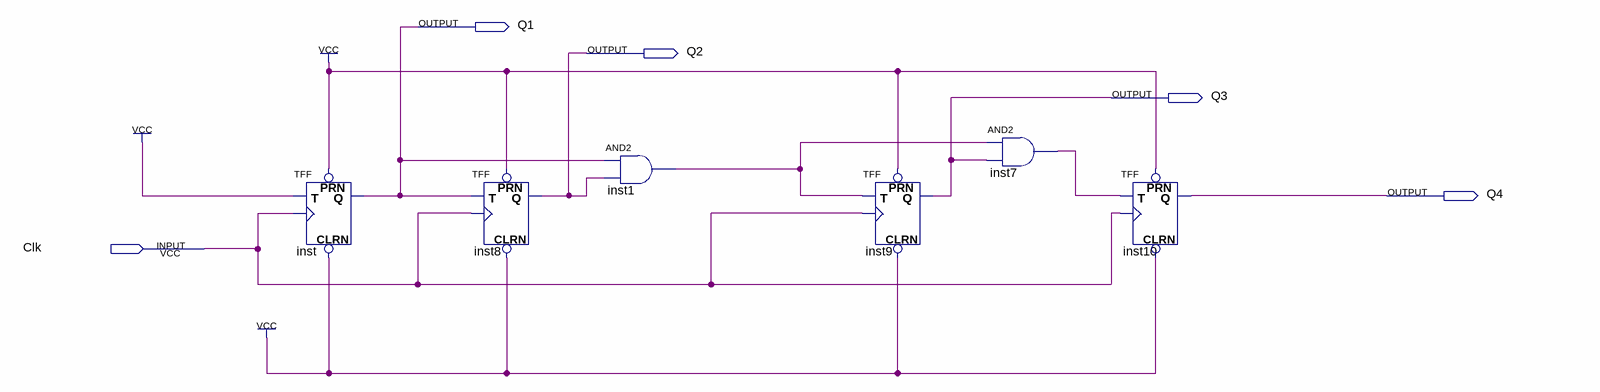
[diagram p0: schematic sheet]
// Quartus schematic lab10step2b.bdf as structural Verilog: 6 symbols, 5 pins
module lab10step2b (
  input  Clk,
  output Q1,
  output Q2,
  output Q3,
  output Q4
);

  wire inst1_out, inst7_out;

  TFF inst (.PRN(1'b1), .CLRN(1'b1), .T(1'b1), .CLK(Clk), .Q(Q1));
  TFF inst8 (.PRN(1'b1), .CLRN(1'b1), .T(Q1), .CLK(Clk), .Q(Q2));
  and inst1 (inst1_out, Q1, Q2);
  TFF inst9 (.PRN(1'b1), .CLRN(1'b1), .T(inst1_out), .CLK(Clk), .Q(Q3));
  and inst7 (inst7_out, inst1_out, Q3);
  TFF inst10 (.PRN(1'b1), .CLRN(1'b1), .T(inst7_out), .CLK(Clk), .Q(Q4));
endmodule
